# EAGLE schematic relay (EAGLE 9.6.1)
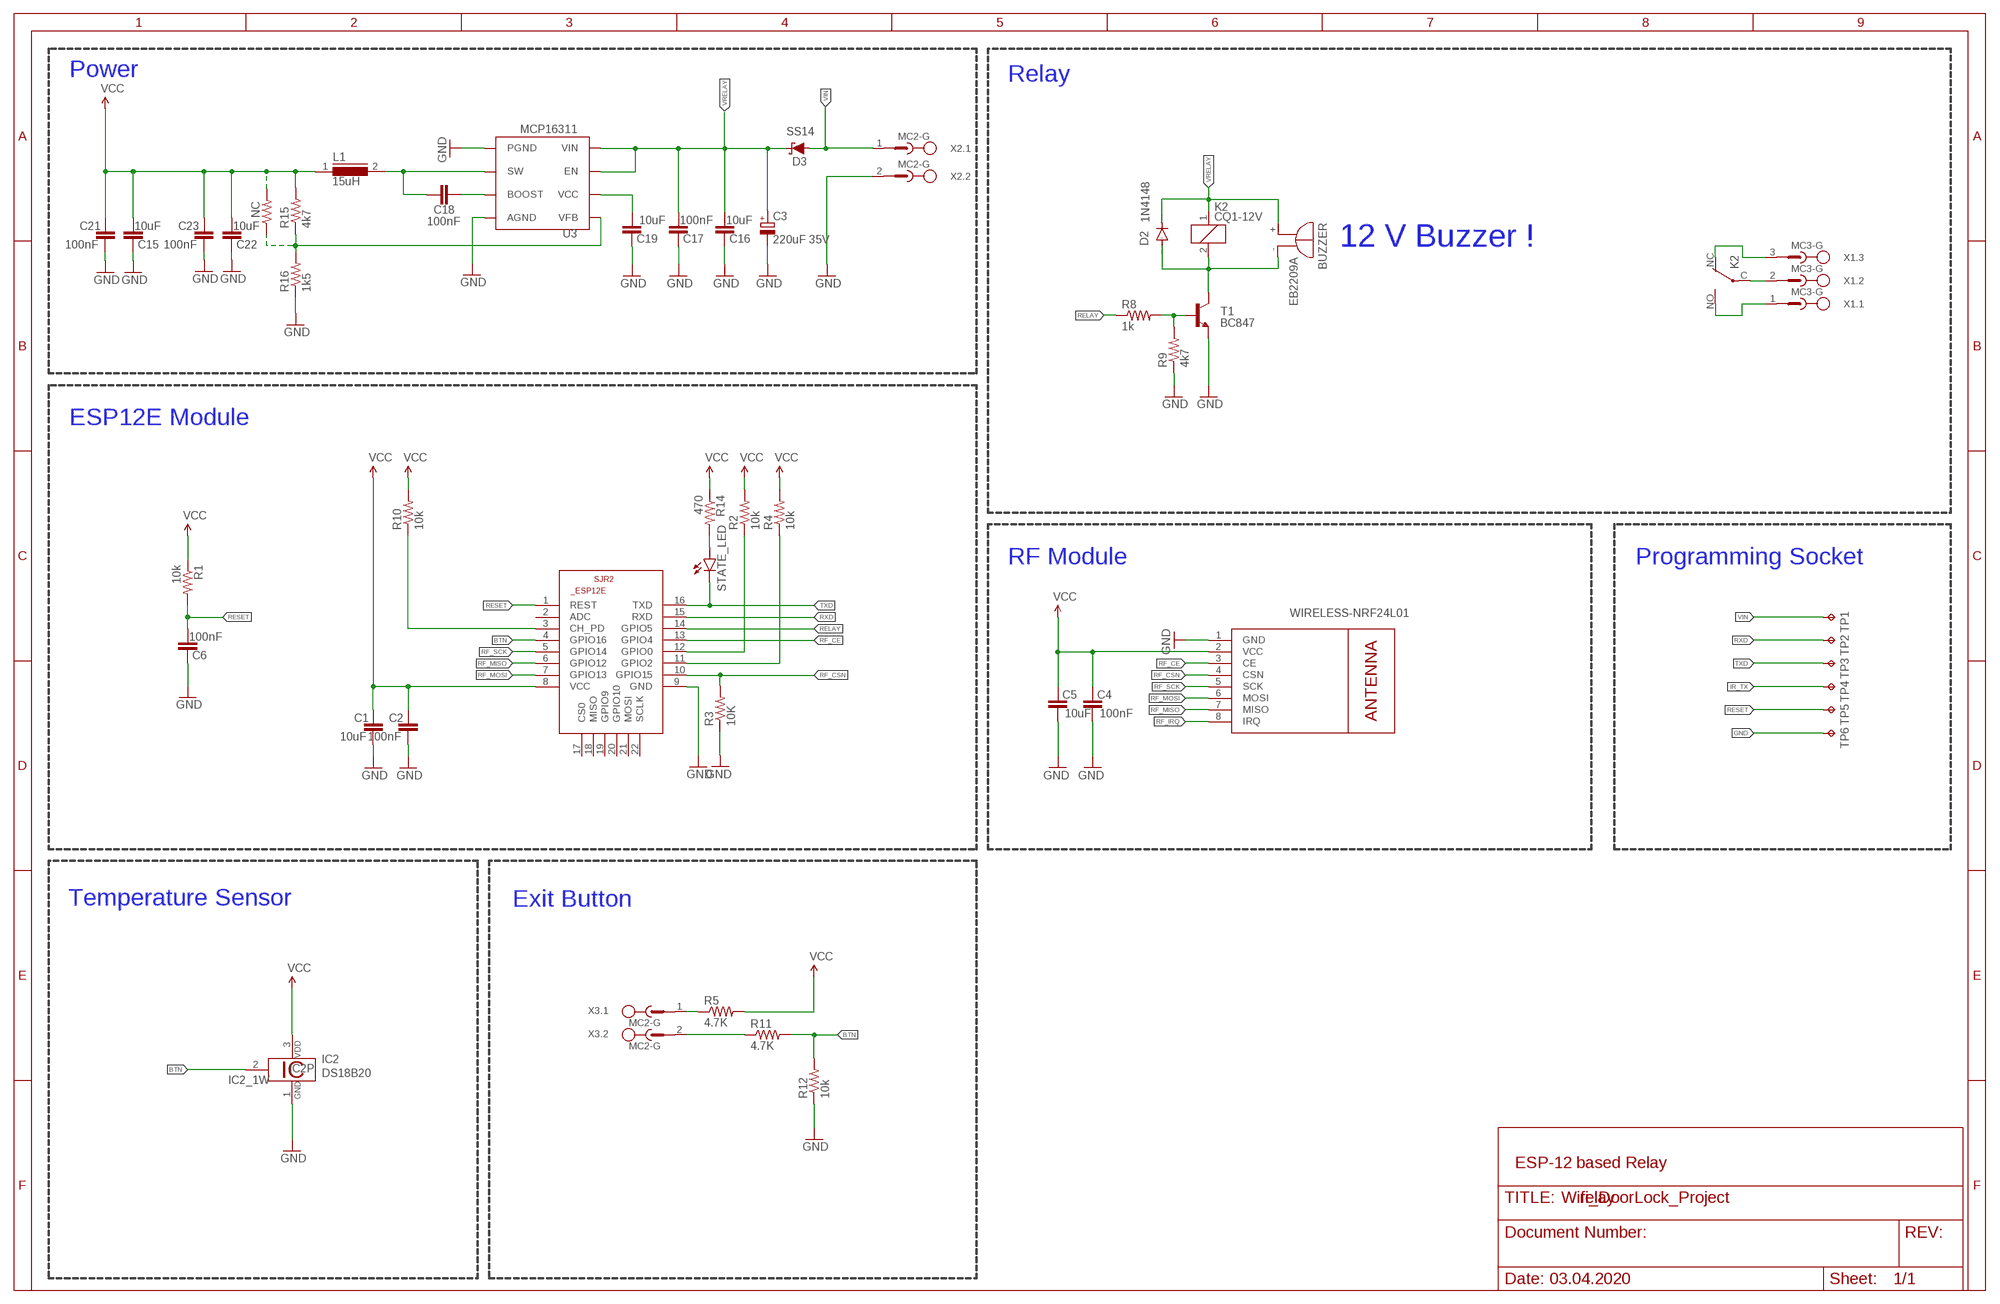
[diagram p0: schematic, sheet 1]

## Parts
BUZZER  EB2209A  [EB2209A]
C1  10uF  C-EUC0805  [C0805]
C2  100nF  C-EUC0805  [C0805]
C3  220uF 35V  CPOL-EU150CLZ-0810  [150CLZ-0810]
C4  100nF  C-EUC0805  [C0805]
C5  10uF  C-EUC0805  [C0805]
C6  100nF  C-EUC0805  [C0805]
C15  10uF  C-EUC0805  [C0805]
C16  10uF  C-EUC0805  [C0805]
C17  100nF  C-EUC0805  [C0805]
C18  100nF  C-EUC0805  [C0805]
C19  10uF  C-EUC0805  [C0805]
C21  100nF  C-EUC0805  [C0805]
C22  10uF  C-EUC0805  [C0805]
C23  100nF  C-EUC0805  [C0805]
D2  1N4148  DIODE-DO-214AC  [DO-214AC]
D3  SS14  DIODE-SCHOTTKY-SS14  [SMA-DIODE]
IC2  DS18B20  [TO92-]
K2  CQ1-12V  [CQ1]
L1  15uH  DR74  [DR74]
M1  WIRELESS-NRF24L01  [WIRELESS-NRF24L01]
NC  R-US_M0805  [M0805]
R1  10k  R-US_M0805  [M0805]
R2  10k  R-US_M0805  [M0805]
R3  10K  R-US_M0805  [M0805]
R4  10k  R-US_M0805  [M0805]
R5  4.7K  R-US_M0805  [M0805]
R8  1k  R-US_M0805  [M0805]
R9  4k7  R-US_M0805  [M0805]
R10  10k  R-US_M0805  [M0805]
R11  4.7K  R-US_M0805  [M0805]
R12  10k  R-US_M0805  [M0805]
R14  470  R-US_M0805  [M0805]
R15  4k7  R-US_M0805  [M0805]
R16  1k5  R-US_M0805  [M0805]
SJR2  ESP8266-12EESP12E  [ESP8266-ESP12E]
STATE_LED  LED3MM  [LED3MM]
T1  BC847  [SOT23]
TP1  TPTP20SQ  [TP20SQ]
TP2  TPTP20SQ  [TP20SQ]
TP3  TPTP20SQ  [TP20SQ]
TP4  TPTP20SQ  [TP20SQ]
TP5  TPTP20SQ  [TP20SQ]
TP6  TPTP20SQ  [TP20SQ]
U3  MCP16311  [MSOP8]
X1  MC3-G  [MC3-G]
X2  MC2-G  [MC2-G]
X3  MC2-G  [MC2-G]

## Nets
BTN: IC2.2 R11.2 R12.2 SJR2.4(GPIO16)
G2: R4.1 SJR2.11(GPIO2)
GND: C1.2 C2.2 C3.- C4.2 C5.2 C6.1 C15.1 C16.1 C17.1 C19.1 C21.2 C22.1 C23.2 IC2.1 M1.1(GND) R3.1 R9.1 R12.1 R16.1 SJR2.9(GND) T1.2(E) TP6.TP U3.AGND U3.PGND X2.2
IR_TX: TP4.TP
N$1: R8.2 R9.2 T1.1(B)
N$2: K2.C(2:P) X1.2
N$3: NC.1 R15.1 R16.2 U3.VFB
N$4: R14.2 STATE_LED.A
N$5: BUZZER.- D2.A K2.2 T1.3(C)
N$6: K2.NC(2:O) X1.3
N$7: K2.NO(2:S) X1.1
N$8: R2.1 SJR2.12(GPIO0)
N$11: R5.1 X3.1
N$12: R11.1 X3.2
N$24: C18.2 L1.2 U3.SW
N$25: C18.1 U3.BOOST
N$27: C19.2 U3.VCC
N$30: R10.1 SJR2.3(CH_PD)
RELAY: R8.1 SJR2.14(GPIO5)
RESET: C6.2 R1.2 SJR2.1(REST) TP5.TP
RF_CE: M1.3(CE) SJR2.13(GPIO4)
RF_CSN: M1.4(CSN) R3.2 SJR2.10(GPIO15)
RF_IRQ: M1.8(IRQ)
RF_MISO: M1.7(MISO) SJR2.6(GPIO12)
RF_MOSI: M1.6(MOSI) SJR2.7(GPIO13)
RF_SCK: M1.5(SCK) SJR2.5(GPIO14)
RXD: SJR2.15(RXD) TP2.TP
TXD: SJR2.16(TXD) STATE_LED.K(C) TP3.TP
VCC: C1.1 C2.1 C4.1 C5.1 C15.2 C21.1 C22.2 C23.1 IC2.3 L1.1 M1.2(VCC) NC.2 R1.1 R2.2 R4.2 R5.2 R10.2 R14.1 R15.2 SJR2.8(VCC)
VIN: D3.A TP1.TP X2.1
VRELAY: BUZZER.+ C3.+ C16.2 C17.2 D2.C D3.C K2.1 U3.EN U3.VIN
Unconnected: SJR2.2(ADC) SJR2.17(CS0) SJR2.18(MISO) SJR2.19(GPIO9) SJR2.20(GPIO10) SJR2.21(MOSI) SJR2.22(SCLK)

## Notes on the sheet
- Power | Relay
- 12 V Buzzer !
- ESP12E Module
- RF Module | Programming Socket
- Temperature Sensor | Exit Button
- ESP-12 based Relay
- Wifi_DoorLock_Project
- 03.04.2020

## Library data of the parts
BUZZER = buzzer:EB2209A: BUZZER Source: Buerklin; OC_FARNELL: unknown; OC_NEWARK: unknown
C1 C2 C4-C6 C15-C19 C21-C23 = rcl:C-EU: CAPACITOR, European symbol; SPICEPREFIX: C
C3 = rcl:CPOL-EU: POLARIZED CAPACITOR, European symbol; SPICEPREFIX: C
D2 = diode:DIODE-: DIODE
D3 = SparkFun-DiscreteSemi:DIODE-SCHOTTKY: Schottky diode A Schottky diode is a semiconductor diode which has a low forward voltage drop and a very fast switching action.; PROD_ID: DIO-08053; VALUE: 1A/40V/500mV
IC2 = 1wire:DS18B20: Programmable Resolution Digital Thermometer This chip provides a onewire thermosensor with approx. 0.5°C accuracy. A programmable over/undertemperure alarm is available. The precision can be set from 9..12 bits. Notes: Vdd must be applied for accurate measurements at low temperatures, as the parasite power circuit otherwise heats the sensor. If parasite power is used, Vdd has to be connected to GND. The DS1822 is a low-cost thermometer chip, the DS18S20 is similar to the DS18B20, but with 9 Bit precision only. Author: Jan Kandziora <jjj@gmx.de>
K2 = relay:CQ1-12V: AUTOMOTIVE QUIET RELAY NAiS Source: http://www.mew-europe.com/.. en_ds_61208_0000.pdf; OC_FARNELL: unknown; OC_NEWARK: unknown
L1 = inductors:DR74: High Power Density, High Efficiency, Shielded Inductors Source: coiltronics_dr_series.pdf; SPICEPREFIX: L
M1 = diy-modules:WIRELESS-NRF24L01: 2.4 GHz Wireless Module based on NRF24L01 chip More details available here: http://www.electrodragon.com/w/NRF24L01 Click here to find device on ebay.com <http://www.ebay.com/sch/nrf24l01+arduino>
NC R1-R5 R8-R12 R14-R16 = rcl:R-US_: RESISTOR, American symbol; SPICEPREFIX: R
SJR2 = esp12e:ESP8266-12E: ESP8266-12E Library for Eagle CAD The author not responsible for any damages or errors!. Created by Suhail jr.lt;/author>
STATE_LED = led:LED: LED OSRAM: - CHIPLED LG R971, LG N971, LY N971, LG Q971, LY Q971, LO R971, LY R971 LH N974, LH R974 LS Q976, LO Q976, LY Q976 LO Q996 - Hyper CHIPLED LW Q18S LB Q993, LB Q99A, LB R99A - SideLED LS A670, LO A670, LY A670, LG A670, LP A670 LB A673, LV A673, LT A673, LW A673 LH A674 LY A675 LS A676, LA A676, LO A676, LY A676, LW A676 LS A679, LY A679, LG A679 - Hyper Micro SIDELED® LS Y876, LA Y876, LO Y876, LY Y876 LT Y87S - SmartLED LW L88C, LW L88S LB L89C, LB L89S, LG L890 LS L89K, LO L89K, LY L89K LS L896, LA L896, LO L896, LY L896 - TOPLED LS T670, LO T670, LY T670, LG T670, LP T670 LSG T670, LSP T670, LSY T670, LOP T670, LYG T670 LG T671, LOG T671, LSG T671 LB T673, LV T673, LT T673, LW T673 LH T674 LS T676, LA T676, LO T676, LY T676, LB T676, LH T676, LSB T676, LW T676 LB T67C, LV T67C, LT T67C, LS T67K, LO T67K, LY T67K, LW E67C LS E67B, LA E67B, LO E67B, LY E67B, LB E67C, LV E67C, LT E67C LW T67C LS T679, LY T679, LG T679 LS T770, LO T770, LY T770, LG T770, LP T770 LB T773, LV T773, LT T773, LW T773 LH T774 LS E675, LA E675, LY E675, LS T675 LS T776, LA T776, LO T776, LY T776, LB T776 LHGB T686 LT T68C, LB T68C - Hyper Mini TOPLED® LB M676 - Mini TOPLED Santana® LG M470 LS M47K, LO M47K, LY M47K Source: http://www.osram.convergy.de LUXEON: - LUMILED® LXK2-PW12-R00, LXK2-PW12-S00, LXK2-PW14-U00, LXK2-PW14-V00 LXK2-PM12-R00, LXK2-PM12-S00, LXK2-PM14-U00 LXK2-PE12-Q00, LXK2-PE12-R00, LXK2-PE12-S00, LXK2-PE14-T00, LXK2-PE14-U00 LXK2-PB12-K00, LXK2-PB12-L00, LXK2-PB12-M00, LXK2-PB14-N00, LXK2-PB14-P00, LXK2-PB14-Q00 LXK2-PR12-L00, LXK2-PR12-M00, LXK2-PR14-Q00, LXK2-PR14-R00 LXK2-PD12-Q00, LXK2-PD12-R00, LXK2-PD12-S00 LXK2-PH12-R00, LXK2-PH12-S00 LXK2-PL12-P00, LXK2-PL12-Q00, LXK2-PL12-R00 Source: www.luxeon.com KINGBRIGHT: KA-3528ASYC Source: www.kingbright.com
T1 = transistor:BC847: NPN TRANSISTOR
TP1-TP6 = testpad:TP: Test pad
U3 = microchip:MCP16311
X1 = con-phoenix-381_l:MC3-G: Mini-Combicon 3.81mm horizontal 3-polig (mit Gegenstecker)
X2 X3 = con-phoenix-381_l:MC2-G: Mini-Combicon 3.81mm horizontal 2-polig (mit Gegenstecker)